# Altium schematic sheet Plate.SchDoc
size A4; SheetNumber: 1; SheetTotal: 1
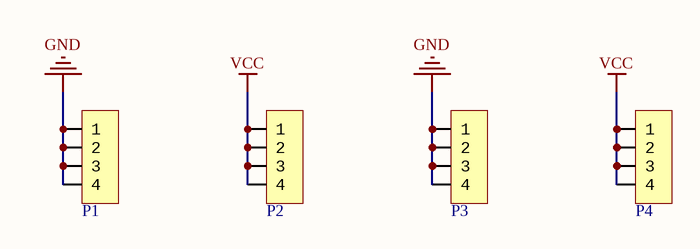
[diagram p0: Plate.SchDoc]

## Parts
P1  HDR1x4_2.54  [HDR_1X4]  (value not drawn)
P2  HDR1x4_2.54  [HDR_1X4]  (value not drawn)
P3  HDR1x4_2.54  [HDR_1X4]  (value not drawn)
P4  HDR1x4_2.54  [HDR_1X4]  (value not drawn)

## Nets
GND: P1.1 P1.2 P1.3 P1.4 P3.1 P3.2 P3.3 P3.4
VCC: P2.1 P2.2 P2.3 P2.4 P4.1 P4.2 P4.3 P4.4

## Library data of the parts
P1-P4 = HDR1x4_2.54: Header